# Altium schematic sheet Project_Information.SchDoc: =project_title
size Tabloid; CompanyName: Luxonis Holding; Organization: Luxonis Holding; Address1: 1925 Harmony Park Drive; Address2: Westminster, CO; Address3: 80234; Address4: United States; SheetNumber: 1; SheetTotal: 17
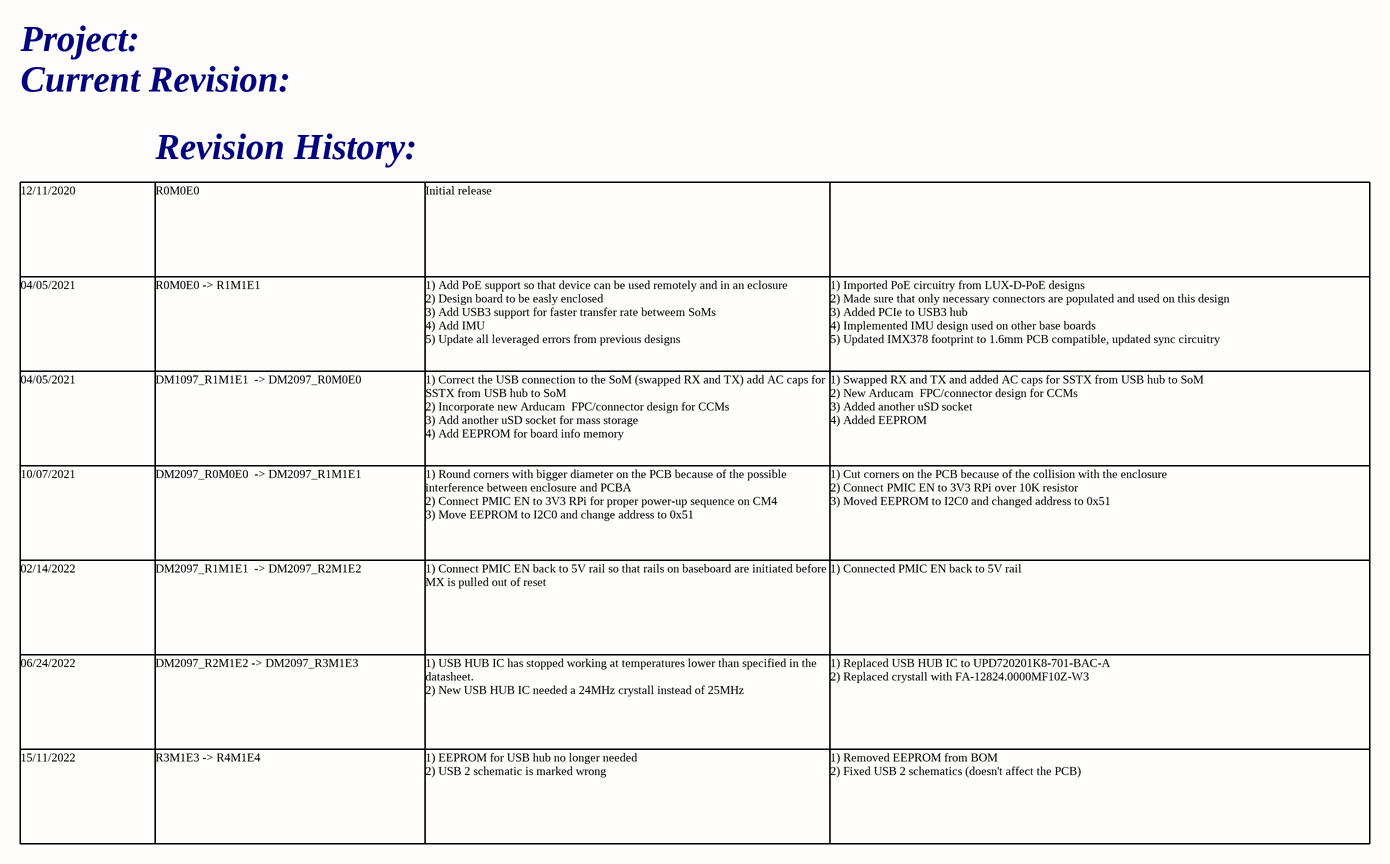
[diagram p0: Project_Information.SchDoc]

## Notes on the sheet
- Project:
- Current Revision:
- Revision History:
- 12/11/2020
- R0M0E0
- Initial release
- 04/05/2021
- R0M0E0 -> R1M1E1
- 1) Add PoE support so that device can be used remotely and in an eclosure
  2) Design board to be easly enclosed
  3) Add USB3 support for faster transfer rate betweem SoMs
  4) Add IMU
  5) Update all leveraged errors from previous designs
- 1) Imported PoE circuitry from LUX-D-PoE designs
  2) Made sure that only necessary connectors are populated and used on this design
  3) Added PCIe to USB3 hub
  4) Implemented IMU design used on other base boards
  5) Updated IMX378 footprint to 1.6mm PCB compatible, updated sync circuitry
- DM1097_R1M1E1  -> DM2097_R0M0E0
- 1) Correct the USB connection to the SoM (swapped RX and TX) add AC caps for SSTX from USB hub to SoM
  2) Incorporate new Arducam  FPC/connector design for CCMs
  3) Add another uSD socket for mass storage
  4) Add EEPROM for board info memory
- 1) Swapped RX and TX and added AC caps for SSTX from USB hub to SoM
  2) New Arducam  FPC/connector design for CCMs
  3) Added another uSD socket
  4) Added EEPROM
- 10/07/2021
- DM2097_R0M0E0  -> DM2097_R1M1E1
- 1) Round corners with bigger diameter on the PCB because of the possible interference between enclosure and PCBA
  2) Connect PMIC EN to 3V3 RPi for proper power-up sequence on CM4
  3) Move EEPROM to I2C0 and change address to 0x51
- 1) Cut corners on the PCB because of the collision with the enclosure
  2) Connect PMIC EN to 3V3 RPi over 10K resistor
  3) Moved EEPROM to I2C0 and changed address to 0x51
- 02/14/2022
- DM2097_R1M1E1  -> DM2097_R2M1E2
- 1) Connect PMIC EN back to 5V rail so that rails on baseboard are initiated before MX is pulled out of reset
- 1) Connected PMIC EN back to 5V rail
- 06/24/2022
- DM2097_R2M1E2 -> DM2097_R3M1E3
- 1) USB HUB IC has stopped working at temperatures lower than specified in the datasheet.
  2) New USB HUB IC needed a 24MHz crystall instead of 25MHz
- 1) Replaced USB HUB IC to UPD720201K8-701-BAC-A
  2) Replaced crystall with FA-12824.0000MF10Z-W3
- 15/11/2022
- R3M1E3 -> R4M1E4
- 1) EEPROM for USB hub no longer needed
  2) USB 2 schematic is marked wrong
- 1) Removed EEPROM from BOM
  2) Fixed USB 2 schematics (doesn't affect the PCB)
- Title
- Size:
- Date:
- Tabloid
- Number:
- Time:
- Revision:
- Sheet
- of
- Drawn by: